# EAGLE design ECU Adapter (EAGLE 9.6.2)
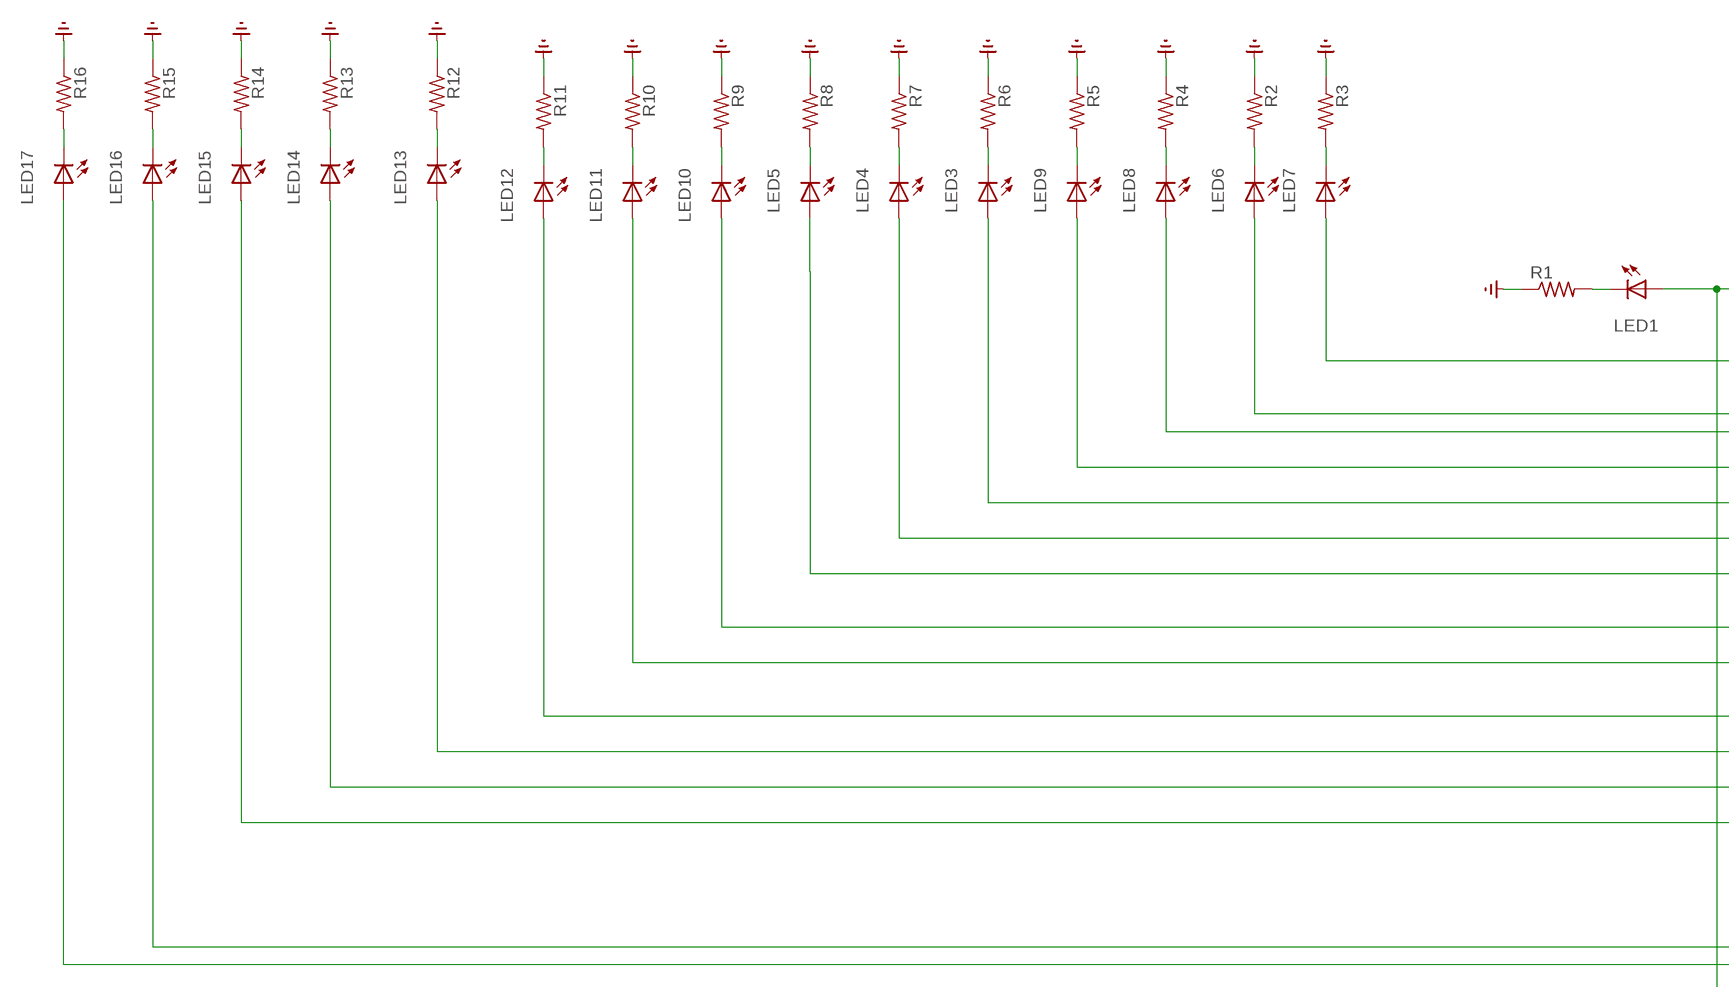
[diagram p0: schematic, sheet 1, part 1 of 2]
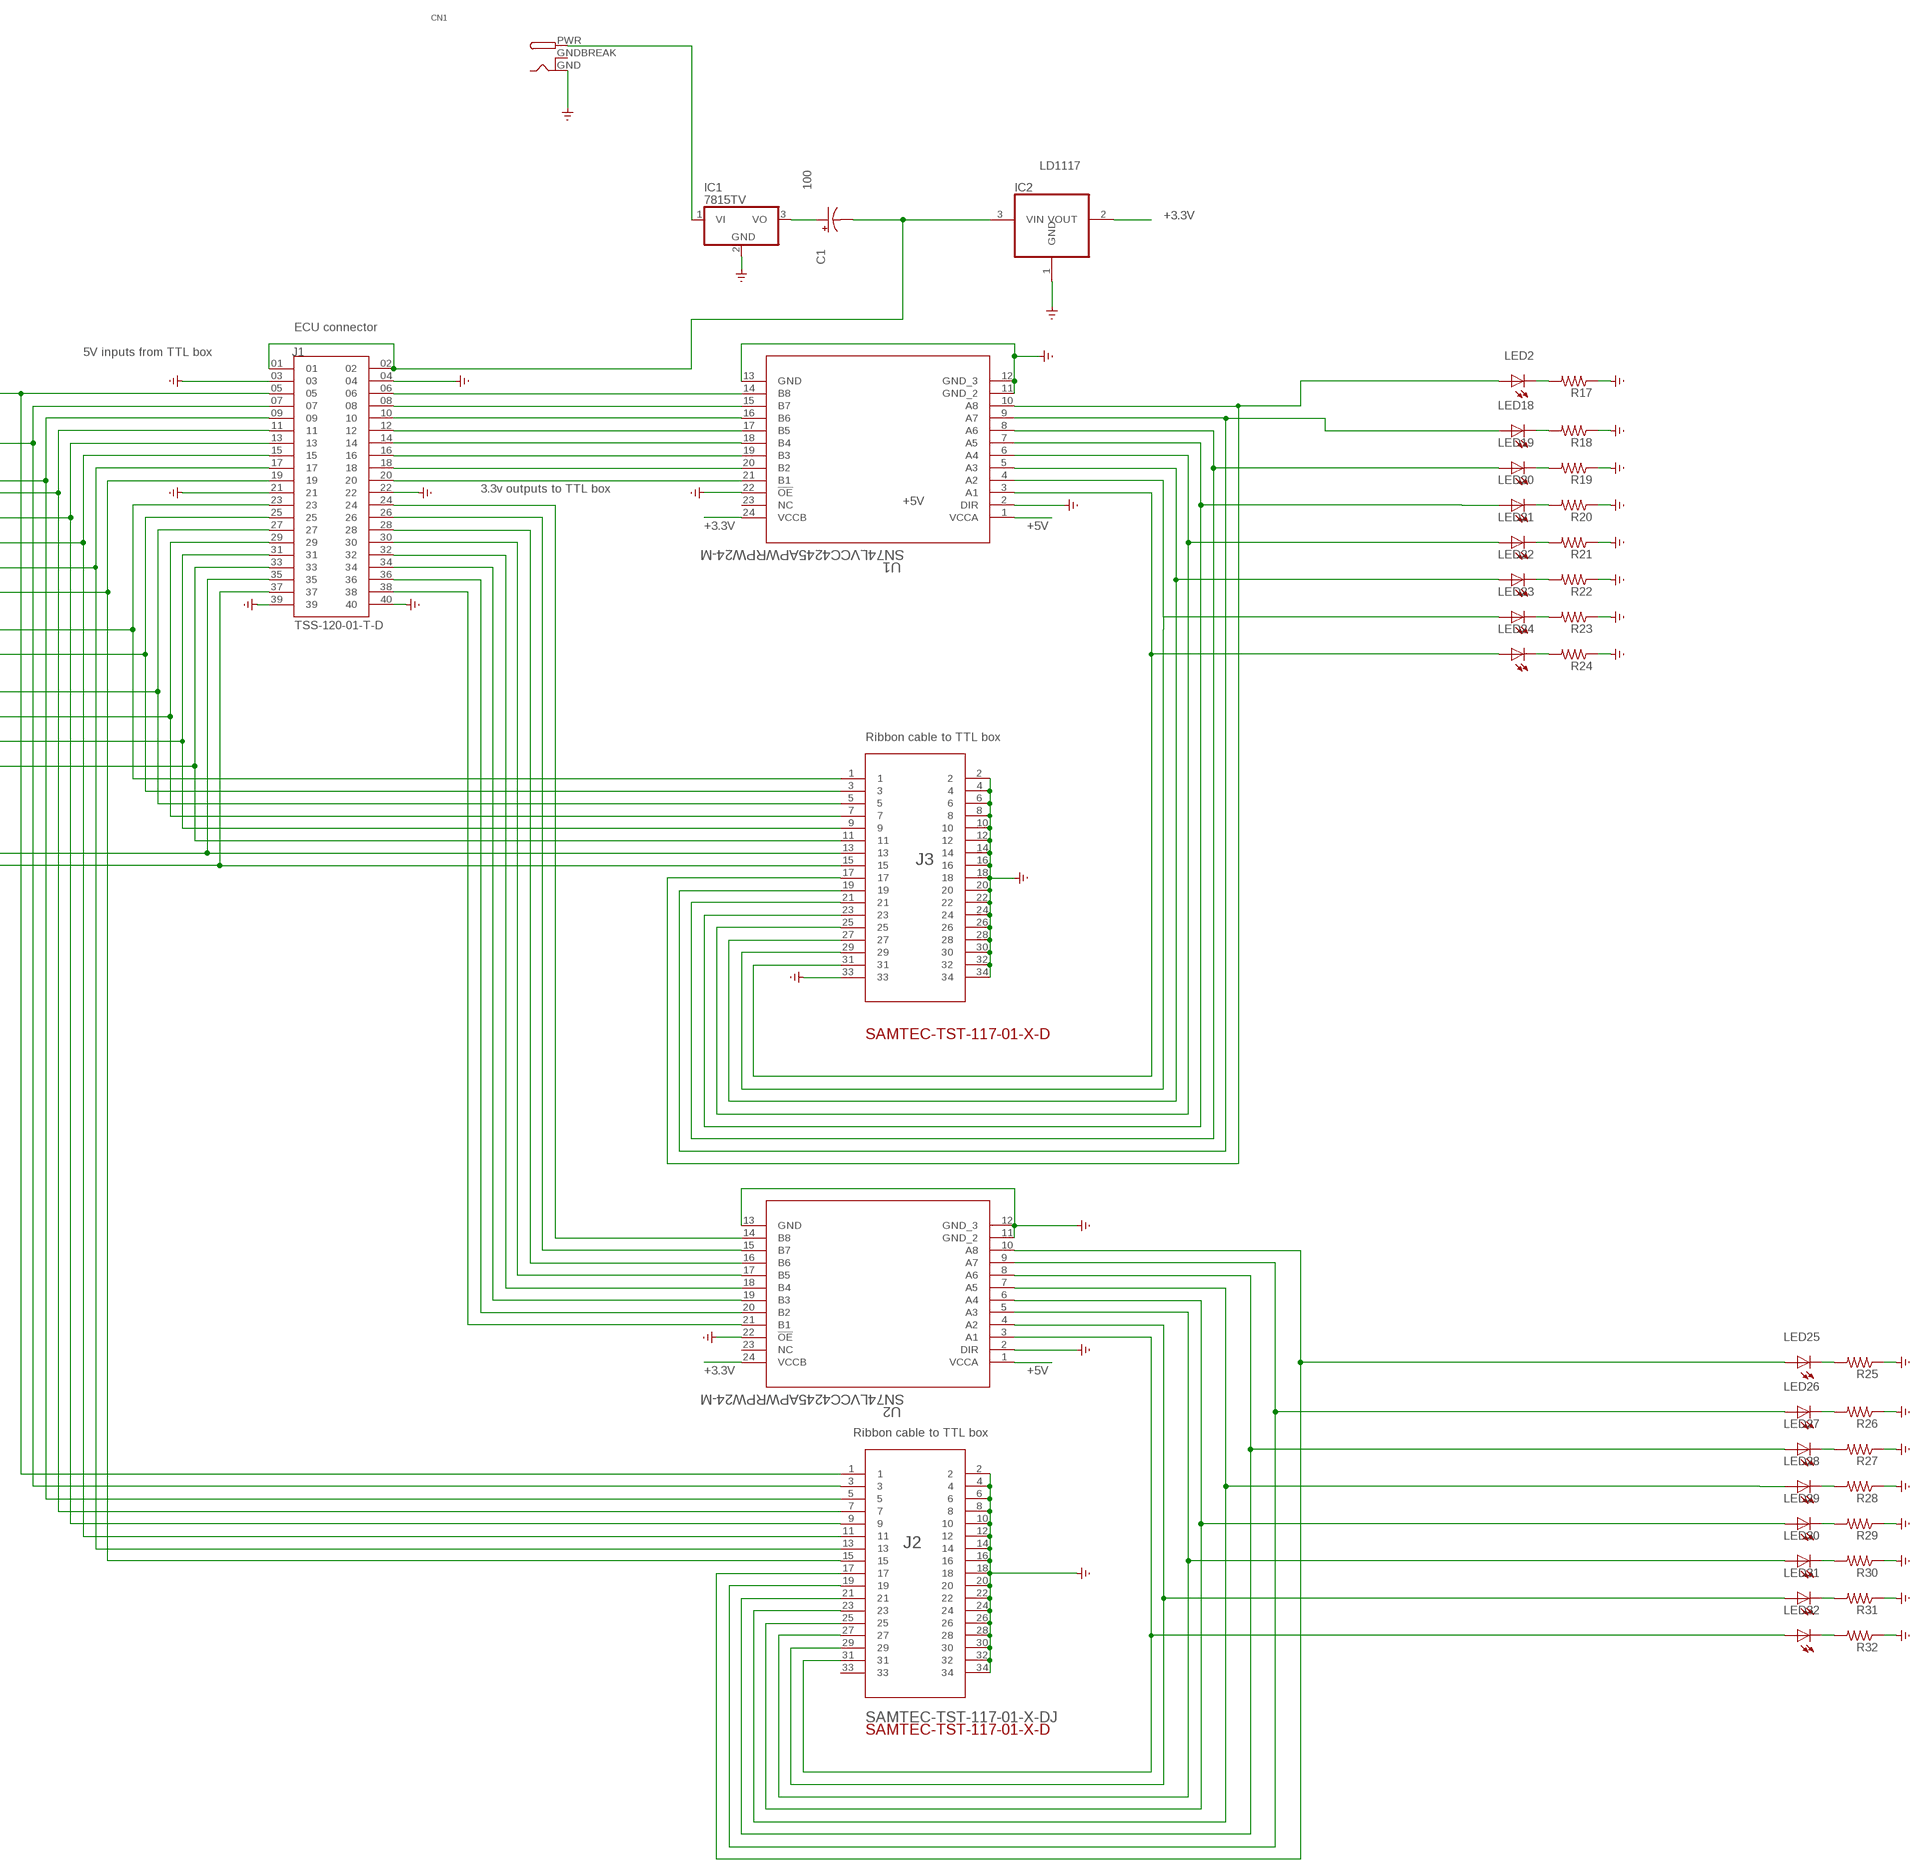
[diagram p1: schematic, sheet 1, part 2 of 2]

## Parts
C1  100  CPOL-USE3.5-10  [E3,5-10]
CN1  DCBARRELPTH  [DCJACK_2MM_PTH]
IC1  7815TV  [TO220V]
IC2  LD1117  [SOT223]
J1  TSS-120-01-T-D  [SAMTEC_TSS-120-01-T-D]
J2  SAMTEC-TST-117-01-X-DJ  [SAMTEC-TST-117-01-X-D]
J3  SAMTEC-TST-117-01-X-DJ  [SAMTEC-TST-117-01-X-D]
LED1  LEDCHIPLED_0603  [CHIPLED_0603]
LED2  LEDCHIPLED_0603  [CHIPLED_0603]
LED3  LEDCHIPLED_0603  [CHIPLED_0603]
LED4  LEDCHIPLED_0603  [CHIPLED_0603]
LED5  LEDCHIPLED_0603  [CHIPLED_0603]
LED6  LEDCHIPLED_0603  [CHIPLED_0603]
LED7  LEDCHIPLED_0603  [CHIPLED_0603]
LED8  LEDCHIPLED_0603  [CHIPLED_0603]
LED9  LEDCHIPLED_0603  [CHIPLED_0603]
LED10  LEDCHIPLED_0603  [CHIPLED_0603]
LED11  LEDCHIPLED_0603  [CHIPLED_0603]
LED12  LEDCHIPLED_0603  [CHIPLED_0603]
LED13  LEDCHIPLED_0603  [CHIPLED_0603]
LED14  LEDCHIPLED_0603  [CHIPLED_0603]
LED15  LEDCHIPLED_0603  [CHIPLED_0603]
LED16  LEDCHIPLED_0603  [CHIPLED_0603]
LED17  LEDCHIPLED_0603  [CHIPLED_0603]
LED18  LEDCHIPLED_0603  [CHIPLED_0603]
LED19  LEDCHIPLED_0603  [CHIPLED_0603]
LED20  LEDCHIPLED_0603  [CHIPLED_0603]
LED21  LEDCHIPLED_0603  [CHIPLED_0603]
LED22  LEDCHIPLED_0603  [CHIPLED_0603]
LED23  LEDCHIPLED_0603  [CHIPLED_0603]
LED24  LEDCHIPLED_0603  [CHIPLED_0603]
LED25  LEDCHIPLED_0603  [CHIPLED_0603]
LED26  LEDCHIPLED_0603  [CHIPLED_0603]
LED27  LEDCHIPLED_0603  [CHIPLED_0603]
LED28  LEDCHIPLED_0603  [CHIPLED_0603]
LED29  LEDCHIPLED_0603  [CHIPLED_0603]
LED30  LEDCHIPLED_0603  [CHIPLED_0603]
LED31  LEDCHIPLED_0603  [CHIPLED_0603]
LED32  LEDCHIPLED_0603  [CHIPLED_0603]
R1  R-US_R0603  [R0603]
R2  R-US_R0603  [R0603]
R3  R-US_R0603  [R0603]
R4  R-US_R0603  [R0603]
R5  R-US_R0603  [R0603]
R6  R-US_R0603  [R0603]
R7  R-US_R0603  [R0603]
R8  R-US_R0603  [R0603]
R9  R-US_R0603  [R0603]
R10  R-US_R0603  [R0603]
R11  R-US_R0603  [R0603]
R12  R-US_R0603  [R0603]
R13  R-US_R0603  [R0603]
R14  R-US_R0603  [R0603]
R15  R-US_R0603  [R0603]
R16  R-US_R0603  [R0603]
R17  R-US_R0603  [R0603]
R18  R-US_R0603  [R0603]
R19  R-US_R0603  [R0603]
R20  R-US_R0603  [R0603]
R21  R-US_R0603  [R0603]
R22  R-US_R0603  [R0603]
R23  R-US_R0603  [R0603]
R24  R-US_R0603  [R0603]
R25  R-US_R0603  [R0603]
R26  R-US_R0603  [R0603]
R27  R-US_R0603  [R0603]
R28  R-US_R0603  [R0603]
R29  R-US_R0603  [R0603]
R30  R-US_R0603  [R0603]
R31  R-US_R0603  [R0603]
R32  R-US_R0603  [R0603]
U1  SN74LVCC4245APWRPW24-M  [PW24-M]
U2  SN74LVCC4245APWRPW24-M  [PW24-M]

## Nets
+3.3V: IC2.2(VOUT) U1.24(VCCB) U2.24(VCCB)
+5V: C1.- IC2.3(VIN) J1.01 J1.02 U1.1(VCCA) U2.1(VCCA)
GND: CN1.GND IC1.2(GND) IC2.1(GND) J1.03 J1.04 J1.21 J1.22 J1.39 J1.40 J2.2 J2.4 J2.6 J2.8 J2.10 J2.12 J2.14 J2.16 J2.18 J2.20 J2.22 J2.24 J2.26 J2.28 J2.30 J2.32 J2.34 J3.2 J3.4 J3.6 J3.8 J3.10 J3.12 J3.14 J3.16 J3.18 J3.20 J3.22 J3.24 J3.26 J3.28 J3.30 J3.32 J3.33 J3.34 R1.1 R2.1 R3.1 R4.1 R5.1 R6.1 R7.1 R8.1 R9.1 R10.1 R11.1 R12.1 R13.1 R14.1 R15.1 R16.1 R17.1 R18.1 R19.1 R20.1 R21.1 R22.1 R23.1 R24.1 R25.1 R26.1 R27.1 R28.1 R29.1 R30.1 R31.1 R32.1 U1.2(DIR) U1.11(GND_2) U1.12(GND_3) U1.13(GND) U1.22(!OE) U2.2(DIR) U2.11(GND_2) U2.12(GND_3) U2.13(GND) U2.22(!OE) ; supply symbol labelled SUPPLY0_GND_
N$1: CN1.PWR IC1.1(VI)
N$2: C1.+ IC1.3(VO)
N$4: J2.17 LED25.A U2.10(A8)
N$6: LED25.C R25.2
N$7: LED26.C R26.2
N$8: J1.06 U1.14(B8)
N$9: J1.08 U1.15(B7)
N$10: J1.10 U1.16(B6)
N$11: J1.12 U1.17(B5)
N$12: J1.14 U1.18(B4)
N$13: J1.16 U1.19(B3)
N$14: J1.18 U1.20(B2)
N$15: J1.20 U1.21(B1)
N$17: LED27.C R27.2
N$18: J1.24 U2.14(B8)
N$19: J1.26 U2.15(B7)
N$20: J1.28 U2.16(B6)
N$21: J1.05 J2.1 LED1.A
N$22: J1.29 J3.7 LED13.A
N$23: LED13.C R12.2
N$24: J1.31 J3.9 LED14.A
N$25: LED14.C R13.2
N$26: J1.33 J3.11 LED15.A
N$27: LED15.C R14.2
N$28: J1.35 J3.13 LED16.A
N$29: J2.19 LED26.A U2.9(A7)
N$30: J2.21 LED27.A U2.8(A6)
N$32: J2.25 LED29.A U2.6(A4)
N$33: J2.27 LED30.A U2.5(A3)
N$34: J2.29 LED31.A U2.4(A2)
N$35: J2.31 LED32.A U2.3(A1)
N$36: LED16.C R15.2
N$37: J3.17 LED2.A U1.10(A8)
N$38: LED17.C R16.2
N$39: LED2.C R17.2
N$40: J2.23 LED28.A U2.7(A5)
N$41: LED18.C R18.2
N$42: J3.21 LED19.A U1.8(A6)
N$43: J1.37 J3.15 LED17.A
N$44: J1.30 U2.17(B5)
N$45: J3.19 LED18.A U1.9(A7)
N$46: J1.32 U2.18(B4)
N$47: LED28.C R28.2
N$48: J1.34 U2.19(B3)
N$49: J1.36 U2.20(B2)
N$50: J1.38 U2.21(B1)
N$51: LED1.C R1.2
N$52: J1.09 J2.5 LED6.A
N$53: LED6.C R2.2
N$54: J1.07 J2.3 LED7.A
N$55: LED7.C R3.2
N$56: J1.11 J2.7 LED8.A
N$57: LED8.C R4.2
N$59: J1.13 J2.9 LED9.A
N$60: LED9.C R5.2
N$61: J1.15 J2.11 LED3.A
N$62: LED3.C R6.2
N$63: J1.17 J2.13 LED4.A
N$64: LED4.C R7.2
N$65: J1.19 J2.15 LED5.A
N$66: LED5.C R8.2
N$67: J1.23 J3.1 LED10.A
N$68: LED10.C R9.2
N$69: J1.25 J3.3 LED11.A
N$70: LED11.C R10.2
N$71: J1.27 J3.5 LED12.A
N$72: LED12.C R11.2
N$73: LED19.C R19.2
N$74: J3.23 LED20.A U1.7(A5)
N$75: LED20.C R20.2
N$76: J3.25 LED21.A U1.6(A4)
N$77: LED21.C R21.2
N$78: J3.27 LED22.A U1.5(A3)
N$79: LED22.C R22.2
N$80: J3.29 LED23.A U1.4(A2)
N$81: LED23.C R23.2
N$82: J3.31 LED24.A U1.3(A1)
N$83: LED24.C R24.2
N$85: LED29.C R29.2
N$87: LED30.C R30.2
N$89: LED31.C R31.2
N$91: LED32.C R32.2
Unconnected: J2.33 U1.23(NC) U2.23(NC)

## Notes on the sheet
- ECU connector
- 5V inputs from TTL box
- 3.3v outputs to TTL box
- Ribbon cable to TTL box
- Ribbon cable to TTL box

## Power pins joined to a net without a drawn wire
GNDBREAK: CN1.GNDBREAK

## Library data of the parts
C1 = adafruit:CPOL-US: POLARIZED CAPACITOR, American symbol
CN1 = adafruit:DCBARREL: 2.0mm DC Barrel Jack DCJACK_2MM_PTH - Through Hole Jack (4UConnector: 05537)
IC1 = linear:78*: Positive VOLTAGE REGULATOR Source: http://cache.national.com/ds/LM/LM78L05.pdf http://www.fairchildsemi.com/ds/LM/LM7805.pdf
IC2 = PulseOximeterECG_AU:LD1117: 800mA and 1A Low Dropout (LDO) Positive Regulator 1.8V, 2.5V, 2.85V, 3.3V, 5V, and Adj; MF: TEXAS INSTRUMENTS; MPN: REG1117FAKTTT; OC_FARNELL: 1296120; OC_NEWARK: 87H2562
J1 = 40pin ribbon connector:TSS-120-01-T-D; DESCRIPTION: Connector Header Through Hole 40 position 0.100 (2.54mm); MF: Samtec; MP: TSS-120-01-T-D; PACKAGE: None; PURCHASE-URL: https://pricing.snapeda.com/search/part/TSS-120-01-T-D/?ref=eda
J2 J3 = 34 pin connector:SAMTEC-TST-117-01-X-D; DESCRIPTION: TST - Samtec 2.54mm Shrouded Through Hole Terminal Strip Cable Mate; DIGI-KEY_PART_NUMBER: TST-117-01-L-D-LL-ND; MF: Samtec Inc.; MP: TST-117-01-L-D; PACKAGE: None; PURCHASE-URL: https://pricing.snapeda.com/search/part/TST-117-01-L-D/?ref=eda
LED1-LED32 = adafruit:LED: LED OSRAM: - CHIPLED LG R971, LG N971, LY N971, LG Q971, LY Q971, LO R971, LY R971 LH N974, LH R974 LS Q976, LO Q976, LY Q976 LO Q996 - Hyper CHIPLED LW Q18S LB Q993, LB Q99A, LB R99A - SideLED LS A670, LO A670, LY A670, LG A670, LP A670 LB A673, LV A673, LT A673, LW A673 LH A674 LY A675 LS A676, LA A676, LO A676, LY A676, LW A676 LS A679, LY A679, LG A679 - Hyper Micro SIDELED® LS Y876, LA Y876, LO Y876, LY Y876 LT Y87S - SmartLED LW L88C, LW L88S LB L89C, LB L89S, LG L890 LS L89K, LO L89K, LY L89K LS L896, LA L896, LO L896, LY L896 - TOPLED LS T670, LO T670, LY T670, LG T670, LP T670 LSG T670, LSP T670, LSY T670, LOP T670, LYG T670 LG T671, LOG T671, LSG T671 LB T673, LV T673, LT T673, LW T673 LH T674 LS T676, LA T676, LO T676, LY T676, LB T676, LH T676, LSB T676, LW T676 LB T67C, LV T67C, LT T67C, LS T67K, LO T67K, LY T67K, LW E67C LS E67B, LA E67B, LO E67B, LY E67B, LB E67C, LV E67C, LT E67C LW T67C LS T679, LY T679, LG T679 LS T770, LO T770, LY T770, LG T770, LP T770 LB T773, LV T773, LT T773, LW T773 LH T774 LS E675, LA E675, LY E675, LS T675 LS T776, LA T776, LO T776, LY T776, LB T776 LHGB T686 LT T68C, LB T68C - Hyper Mini TOPLED® LB M676 - Mini TOPLED Santana® LG M470 LS M47K, LO M47K, LY M47K Source: http://www.osram.convergy.de/
R1-R32 = adafruit:R-US_: RESISTOR, American symbol
U1 U2 = octal level shift 2:SN74LVCC4245APWR; DATASHEET_URL: http://www.ti.com/lit/gpn/SN74LVCC4245A; DESCRIPTION: Octal Bus Transceiver With Adjustable Output Voltage and 3-State Outputs; FAMILY_NAME: DIRECTION CONTROL DUAL SUPPLY TRANSLATOR; GENERIC_PART_NUMBER: SN74LVCC4245A; INDUSTRY_STD_PKG_TYPE: TSSOP; MANUFACTURER: Texas Instruments; MANUFACTURER_PART_NUMBER: SN74LVCC4245APWR; PACKAGE_DESIGNATOR: PW; PIN_COUNT: 24; VENDOR: Texas Instruments

## Board
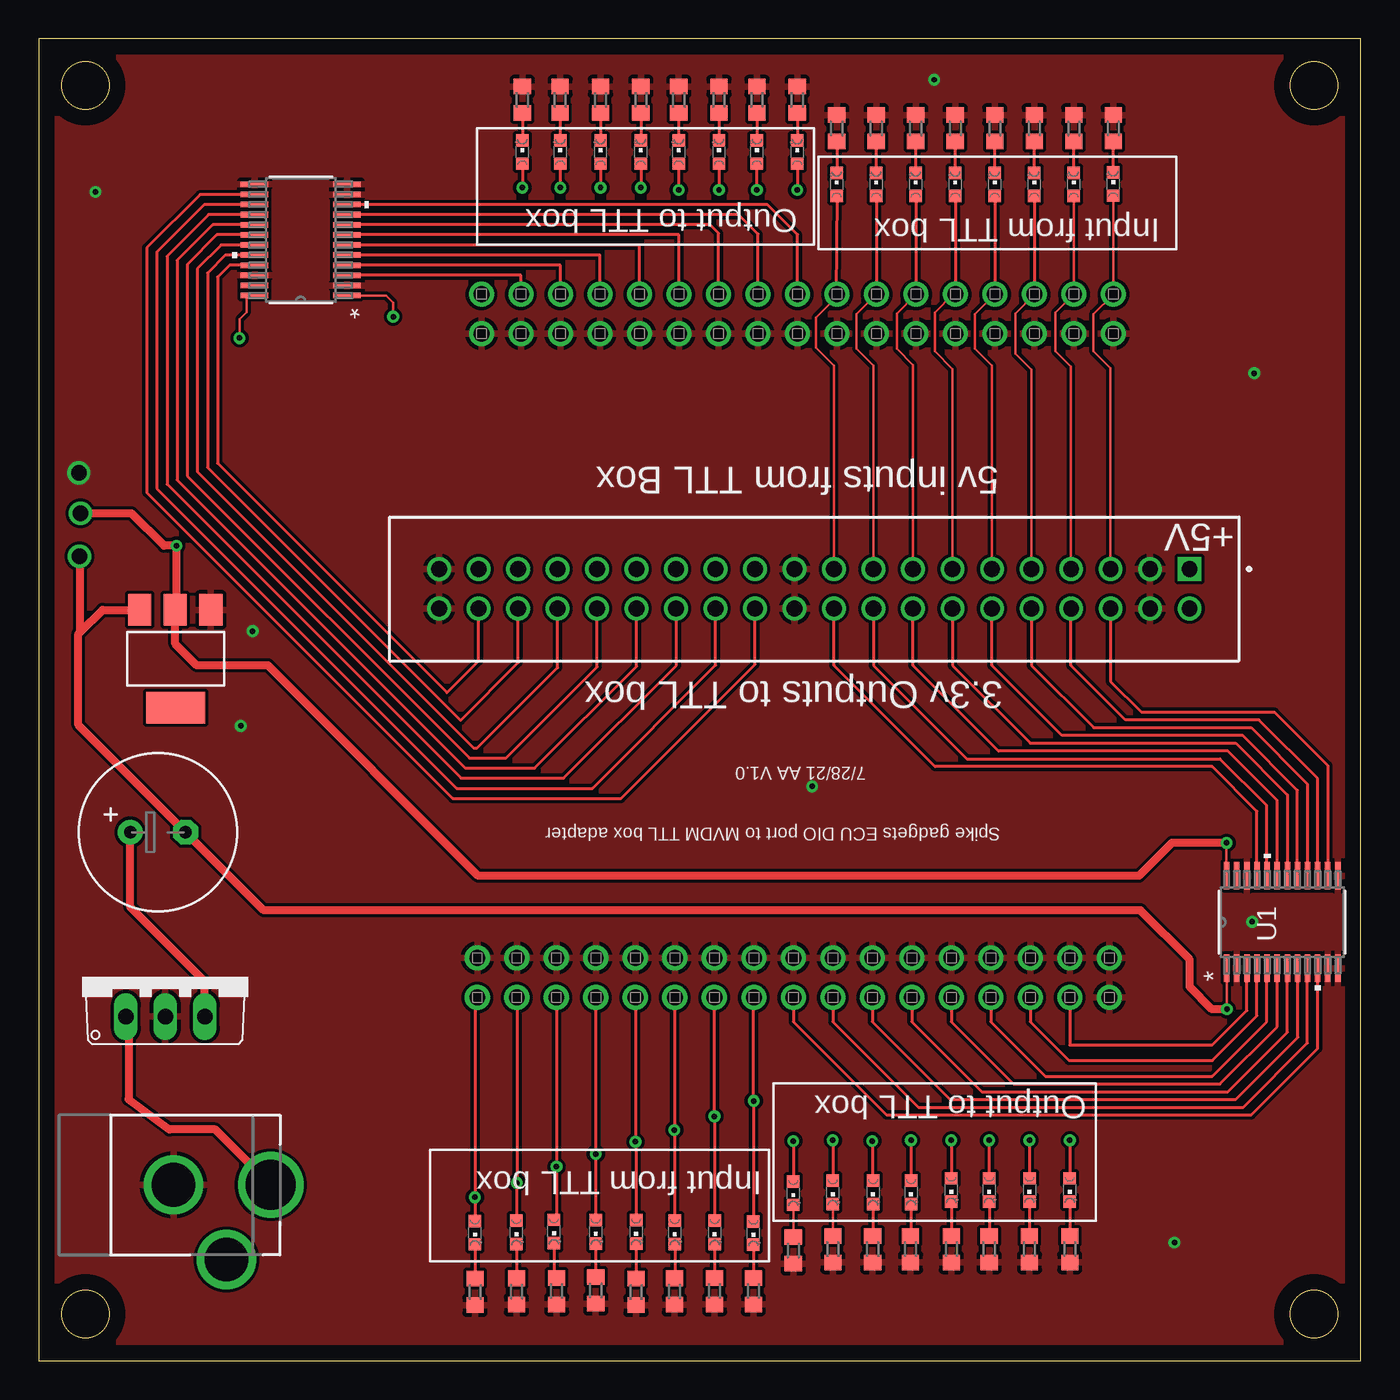
[diagram p2: board, top side]
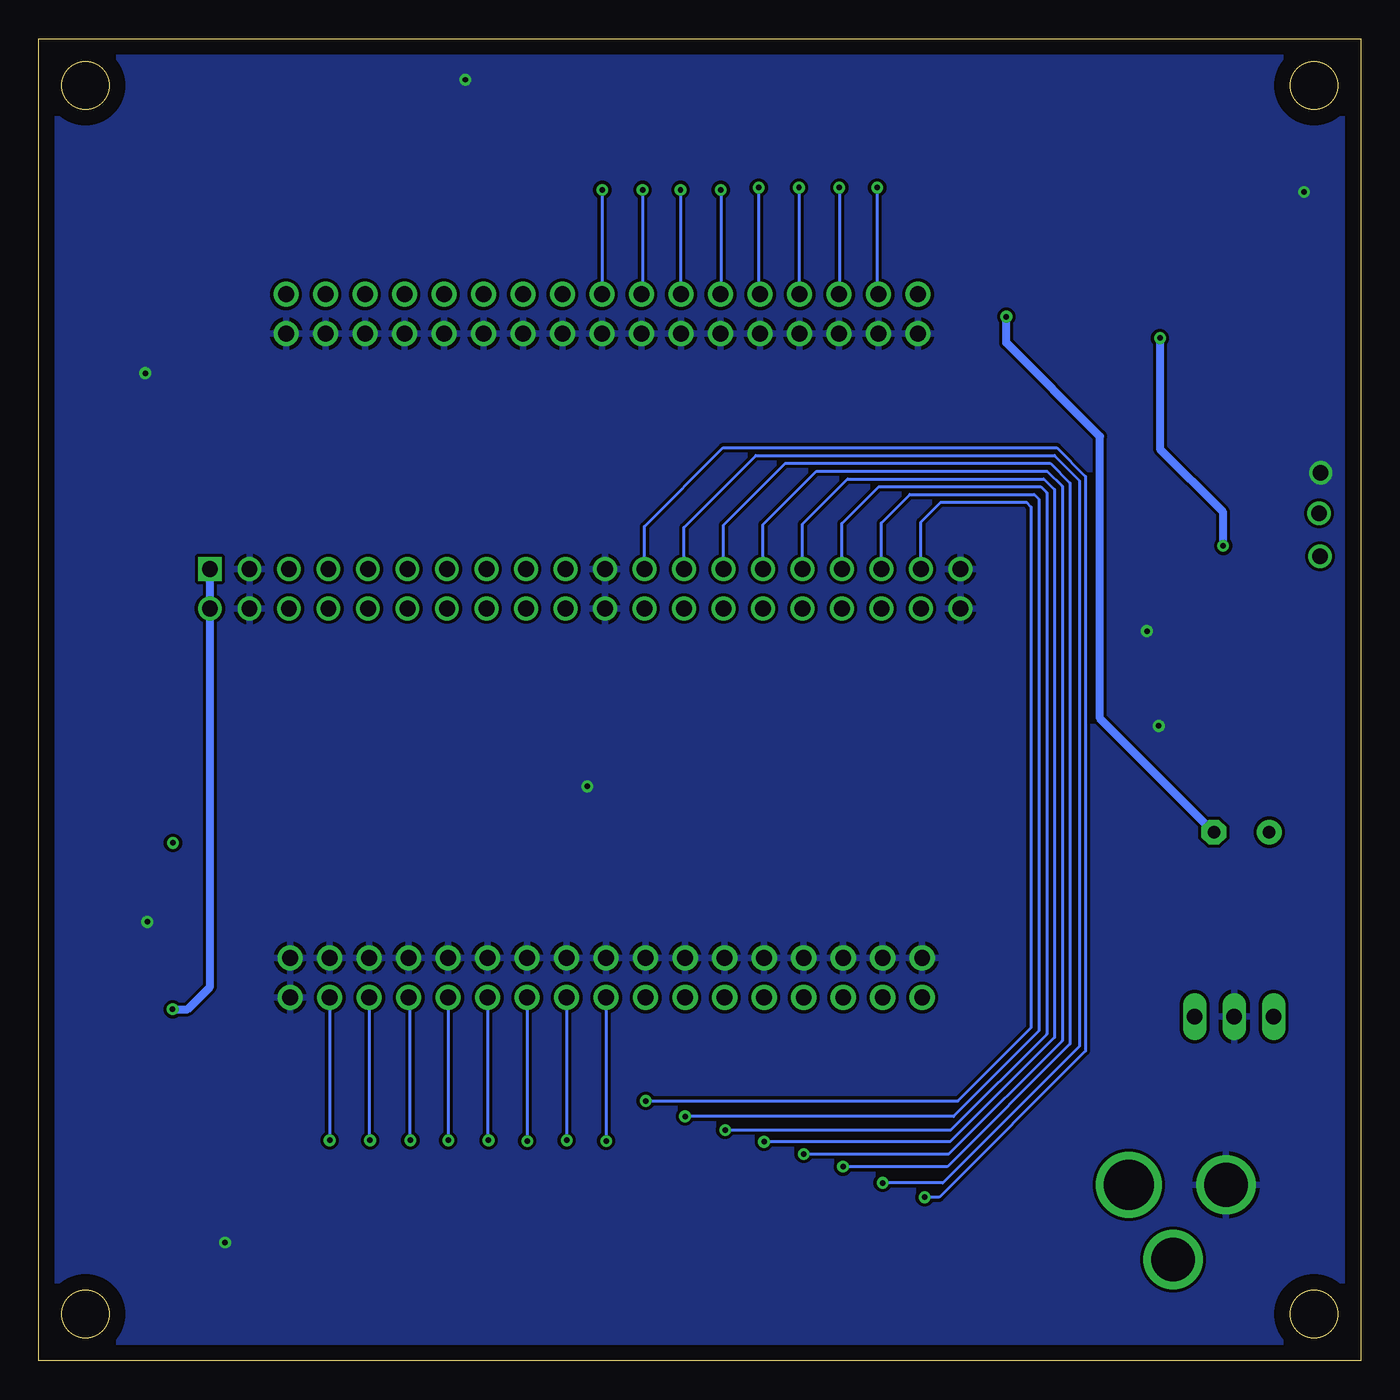
[diagram p3: board, bottom side, seen from below]

Size 85 x 85 mm. Coordinates in mm from the lower left corner, seen from the top.
Outline: 0,0 85,0 85,85 0,85 0,0
Outline: circle at 3,82 radius 1.52
Outline: circle at 82,82 radius 1.52
Outline: circle at 3,3 radius 1.52
Outline: circle at 82,3 radius 1.52
Copper layers (1*16): Top 0.035mm / dielectric 1.5mm / Bottom 0.035mm
Design rules "default": minimum track width 6mil, minimum drill 0.35mm, track to track 6mil, track to pad 6mil, pad to pad 6mil, via to via 6mil, smd to smd 6mil, copper to edge 40mil, drill to drill 6mil, minimum pad ring 10mil, minimum via ring 8mil, stop-mask expansion 4mil, vias tented up to drill 0mil, thermal gap 10mil

### Footprints (pad centres in the part's own frame; a part is rotated, then mirrored left to right if it is on the bottom)
E3,5-10 = drill 0.813 pad 1.6: + -1.778,0 | drill 0.813 pad 1.6 octagon: - 1.778,0
DCJACK_2MM_PTH = drill 2.8: GND 0,7.35; GNDBREAK 4.8,10.75 | drill 3.2: PWR 0,13.6
TO220V = drill 1.016 long: 1 -2.54,-2.54; 2 0,-2.54; 3 2.54,-2.54
SOT223 = smd 1.499 x 2.007: 1 -2.261,-3.15; 2 0.025,-3.15; 3 2.311,-3.15 | smd 3.81 x 2.007: 4 0,3.15
SAMTEC_TSS-120-01-T-D = drill 1.02 pad 1.37 square: 01 0,0 | drill 1.02 pad 1.37: 02 0,2.54; 03 2.54,0; 04 2.54,2.54; 05 5.08,0; 06 5.08,2.54; 07 7.62,0; 08 7.62,2.54; 09 10.16,0; 10 10.16,2.54; 11 12.7,0; 12 12.7,2.54; 13 15.24,0; 14 15.24,2.54; 15 17.78,0; 16 17.78,2.54; 17 20.32,0; 18 20.32,2.54; 19 22.86,0; 20 22.86,2.54; 21 25.4,0; 22 25.4,2.54; 23 27.94,0; 24 27.94,2.54; 25 30.48,0; 26 30.48,2.54; 27 33.02,0; 28 33.02,2.54; 29 35.56,0; 30 35.56,2.54; 31 38.1,0; 32 38.1,2.54; 33 40.64,0; 34 40.64,2.54; 35 43.18,0; 36 43.18,2.54; 37 45.72,0; 38 45.72,2.54; 39 48.26,0; 40 48.26,2.54
SAMTEC-TST-117-01-X-D = drill 1.02 pad 1.62: 1 -20.32,-1.46; 2 -20.32,1.08; 3 -17.78,-1.46; 4 -17.78,1.08; 5 -15.24,-1.46; 6 -15.24,1.08; 7 -12.7,-1.46; 8 -12.7,1.08; 9 -10.16,-1.46; 10 -10.16,1.08; 11 -7.62,-1.46; 12 -7.62,1.08; 13 -5.08,-1.46; 14 -5.08,1.08; 15 -2.54,-1.46; 16 -2.54,1.08; 17 0,-1.46; 18 0,1.08; 19 2.54,-1.46; 20 2.54,1.08; 21 5.08,-1.46; 22 5.08,1.08; 23 7.62,-1.46; 24 7.62,1.08; 25 10.16,-1.46; 26 10.16,1.08; 27 12.7,-1.46; 28 12.7,1.08; 29 15.24,-1.46; 30 15.24,1.08; 31 17.78,-1.46; 32 17.78,1.08; 33 20.32,-1.46; 34 20.32,1.08
CHIPLED_0603 = smd 0.8 x 0.8: A 0,-0.75; C 0,0.75
R0603 = smd 1 x 1.1: 1 -0.85,0; 2 0.85,0
PW24-M = smd 1.778 x 0.356: 1 -2.972,3.575; 2 -2.972,2.925; 3 -2.972,2.275; 4 -2.972,1.625; 5 -2.972,0.975; 6 -2.972,0.325; 7 -2.972,-0.325; 8 -2.972,-0.975; 9 -2.972,-1.625; 10 -2.972,-2.275; 11 -2.972,-2.925; 12 -2.972,-3.575; 13 2.972,-3.575; 14 2.972,-2.925; 15 2.972,-2.275; 16 2.972,-1.625; 17 2.972,-0.975; 18 2.972,-0.325; 19 2.972,0.325; 20 2.972,0.975; 21 2.972,1.625; 22 2.972,2.275; 23 2.972,2.925; 24 2.972,3.575

### Placement (x,y rotation side)
C1  7.66,33.98 0 top
CN1  1.31,11.3 270 top
IC1  8.13,24.66 0 top
IC2  8.8,45.14 180 top
J1  74,50.9 180 top
J2  48.79,67.12 180 top
J3  48.52,24.82 0 top
LED1  69.09,75.67 0 top
LED2  48.51,10.77 180 top
LED3  56.39,75.64 0 top
LED4  53.85,75.64 0 top
LED5  51.31,75.64 0 top
LED6  64.01,75.64 0 top
LED7  66.55,75.64 0 top
LED8  61.47,75.64 0 top
LED9  58.93,75.64 0 top
LED10  28.04,8.23 180 top
LED11  30.71,8.26 180 top
LED12  33.12,8.31 180 top
LED13  35.81,8.28 180 top
LED14  38.4,8.28 180 top
LED15  40.89,8.26 180 top
LED16  43.46,8.26 180 top
LED17  45.95,8.2 180 top
LED18  51.05,10.82 180 top
LED19  53.64,10.82 180 top
LED20  56.08,10.82 180 top
LED21  58.67,10.97 180 top
LED22  61.11,10.97 180 top
LED23  63.7,10.97 180 top
LED24  66.29,10.97 180 top
LED25  48.77,77.72 0 top
LED26  46.18,77.72 0 top
LED27  43.74,77.72 0 top
LED28  41.15,77.72 0 top
LED29  38.71,77.72 0 top
LED30  36.12,77.72 0 top
LED31  33.53,77.72 0 top
LED32  31.09,77.72 0 top
R1  69.09,79.25 270 top
R2  64.01,79.25 270 top
R3  66.55,79.25 270 top
R4  61.47,79.25 270 top
R5  58.93,79.25 270 top
R6  56.39,79.25 270 top
R7  53.85,79.25 270 top
R8  51.31,79.25 270 top
R9  28.04,4.42 90 top
R10  30.71,4.45 90 top
R11  33.3,4.47 90 top
R12  35.81,4.52 90 top
R13  38.4,4.42 90 top
R14  40.87,4.45 90 top
R15  43.46,4.47 90 top
R16  45.95,4.47 90 top
R17  48.51,7.09 90 top
R18  51.05,7.16 90 top
R19  53.62,7.16 90 top
R20  56.06,7.16 90 top
R21  58.67,7.16 90 top
R22  61.11,7.16 90 top
R23  63.7,7.16 90 top
R24  66.29,7.16 90 top
R25  48.77,81.08 270 top
R26  46.18,81.08 270 top
R27  43.74,81.08 270 top
R28  41.15,81.08 270 top
R29  38.71,81.08 270 top
R30  36.12,81.08 270 top
R31  33.53,81.08 270 top
R32  31.09,81.08 270 top
U1  79.96,28.2 90 top
U2  16.84,72.07 180 top

### Tracks (layer width: path | path; a pad name or v marks a point on that pad's centre or on a via)
+3.3V  (via drill 0.35, 1)
  Top 0.152: U2.24 13.81,68.55 13.41,68.55 13.36,68.6 13.36,67.44 12.9,66.98 v12.9,65.76 | U1.24 v76.38,33.3
  Top 0.508: v76.38,33.3 72.87,33.3 70.75,31.18 28.26,31.18 14.73,44.7 10.16,44.7 8.77,46.09 IC2.2 8.84,48.35 v8.84,52.4 8.05,52.4 5.97,54.48 v2.67,54.48
  Bottom 0.508: v8.84,52.4 8.84,54.56 12.9,58.62 v12.9,65.76
+5V  (via drill 0.35, 1)
  Top 0.152: U1.1 76.39,22.61 v76.4,22.6 | U2.1 22.34,68.5 22.78,68.05 v22.78,67.13
  Top 0.508: 2.62,46.81 4.09,48.29 IC2.3 | 2.62,46.81 2.54,46.74 2.54,40.88 C1.- 14.46,28.96 70.84,28.96 74,25.8 74,24.04 75.44,22.6 v76.4,22.6 | v2.62,51.71 2.62,46.81
  Bottom 0.508: C1.- 16.76,41.31 16.76,59.44 22.78,65.46 v22.78,67.13 | v76.4,22.6 75.44,22.6 74,24.05 J1.02 J1.01
GND  (via drill 0.35, 1)
  other vias: 49.73,36.93 78.03,28.22 3.63,75.16 57.58,82.37 78.16,63.5 73.03,7.59 2.57,57.1 12.98,40.82 13.74,46.91
  pour Bottom (isolate 0.203): -4.86,100.49 92.8,100.49 92.8,-7.62 -4.73,-8.22
  pour Top (isolate 0.203): -9.1,103.5 -9.1,-5 90.89,-5 90.89,103.5
N$1
  Top 0.508: IC1.1 5.77,21.95 5.77,16.81 8.4,14.86 11.35,14.86 CN1.PWR
N$2
  Top 0.508: IC1.3 10.67,24.38 5.88,29.17 C1.+
N$4  (via drill 0.35)
  Top 0.203: J2.17 48.79,72.41 46.85,74.34 U2.10 | LED25.A v48.77,75.29
  Bottom 0.203: v48.77,75.29 48.77,68.58 J2.17
N$6
  Top 0.203: R25.2 LED25.C
N$7
  Top 0.203: R26.2 LED26.C
N$8
  Top 0.203: J1.06 68.92,43.69 70.9,41.7 79.46,41.7 82.89,38.28 U1.14
N$9
  Top 0.203: J1.08 66.38,44.7 69.88,41.2 78.46,41.2 82.23,37.43 U1.15
N$10
  Top 0.203: J1.10 63.84,44.7 67.84,40.7 77.96,40.7 81.58,37.08 U1.16
N$11
  Top 0.203: J1.12 61.3,44.7 65.8,40.2 77.41,40.2 80.94,36.68 U1.17
N$12
  Top 0.203: J1.14 58.76,44.7 63.76,39.7 76.96,39.7 80.28,36.38 U1.18
N$13
  Top 0.203: J1.16 56.22,44.7 61.72,39.2 76.46,39.2 79.64,36.03 U1.19
N$14
  Top 0.203: J1.18 53.68,44.7 59.68,38.7 75.96,38.7 78.96,35.7 78.96,31.2 U1.20
N$15
  Top 0.203: J1.20 51.14,44.7 57.64,38.2 75.46,38.2 78.33,35.33 U1.21
N$17
  Top 0.203: R27.2 LED27.C
N$18
  Top 0.203: U2.14 10.37,75 6.94,71.56 6.94,55.82 26.61,36.15 37.44,36.15 46.06,44.77 J1.24
N$19
  Top 0.203: U2.15 10.64,74.34 7.59,71.3 7.59,56.09 26.88,36.8 35.59,36.8 43.52,44.73 J1.26
N$20
  Top 0.203: J1.28 40.99,48.34 40.99,44.7 33.74,37.45 27.15,37.45 8.24,56.36 8.24,71.03 10.91,73.69 U2.16
N$21
  Top 0.152: J2.1 69.09,68.56 | 69.09,68.56 67.82,67.29 67.82,64.92 68.92,63.82 J1.05 | LED1.A 69.09,68.56
N$22  (via drill 0.35)
  Top 0.203: J3.7 v35.82,13.29 v35.81,13.29 LED13.A | LED13.A
  Bottom 0.203: J1.29 38.44,53.76 34.99,57.2 20.16,57.2 19.19,56.23 19.19,20.58 26.48,13.29 v35.81,13.29
N$23
  Top 0.203: LED13.C R12.2
N$24  (via drill 0.35)
  Top 0.203: J3.9 v38.37,14.08 38.41,14.08 LED14.A
  Bottom 0.203: J1.31 35.9,53.8 32.99,56.7 20.37,56.7 19.69,56.02 19.69,20.78 26.4,14.08 v38.37,14.08
N$25
  Top 0.203: LED14.C R13.2
N$26  (via drill 0.35)
  Top 0.203: J3.11 40.89,14.86 v40.87,14.83 40.87,9.01 LED15.A
  Bottom 0.203: J1.33 33.36,53.84 30.99,56.2 20.58,56.2 20.19,55.82 20.19,20.99 26.35,14.83 v40.87,14.83
N$27
  Top 0.203: LED15.C 40.89,5.29 R14.2
N$28  (via drill 0.35)
  Top 0.203: J3.13 v43.44,15.71 v43.44,15.7 43.44,9.01 LED16.A
  Bottom 0.203: J1.35 30.82,53.88 28.99,55.7 20.99,55.7 20.69,55.41 20.69,21.2 26.18,15.7 v43.44,15.7
N$29  (via drill 0.35)
  Top 0.203: J2.19 46.25,72.45 45,73.69 U2.9 | v46.18,75.29 LED26.A
  Bottom 0.203: v46.18,75.29 46.18,68.58 J2.19
N$30  (via drill 0.35)
  Top 0.203: J2.21 43.71,72.49 43.15,73.05 U2.8 | LED27.A v43.74,75.29
  Bottom 0.203: v43.74,75.29 43.74,68.58 J2.21
N$32  (via drill 0.35)
  Top 0.203: J2.25 38.63,71.75 U2.6 | LED29.A v38.71,75.44
  Bottom 0.203: v38.71,75.44 38.71,68.58 J2.25
N$33  (via drill 0.35)
  Top 0.203: J2.27 36.09,71.09 U2.5 | LED30.A v36.12,75.44
  Bottom 0.203: v36.12,75.44 36.12,68.58 J2.27
N$34  (via drill 0.35)
  Top 0.203: J2.29 33.55,70.44 U2.4 | LED31.A v33.53,75.44
  Bottom 0.203: v33.53,75.44 33.53,68.58 J2.29
N$35  (via drill 0.35)
  Top 0.203: J2.31 31.01,69.8 U2.3 | LED32.A v31.09,75.44
  Bottom 0.203: v31.09,75.44 31.09,68.58 J2.31
N$36
  Top 0.203: LED16.C R15.2
N$37  (via drill 0.35)
  Top 0.203: J3.17 48.52,21.8 54.52,15.79 77.96,15.79 82.23,20.07 U1.10 | v48.51,14.12 LED2.A
  Bottom 0.203: J3.17 v48.52,14.12 v48.51,14.12
N$38
  Top 0.203: LED17.C R16.2
N$39
  Top 0.152: LED2.C R17.2
N$40  (via drill 0.35)
  Top 0.203: J2.23 41.17,72.39 U2.7 | LED28.A v41.15,75.29
  Bottom 0.203: v41.15,75.29 41.15,68.58 J2.23
N$41
  Top 0.152: LED18.C R18.2
N$42  (via drill 0.35)
  Top 0.203: J3.21 53.6,21.8 58.6,16.8 76.96,16.8 80.96,20.8 80.96,25.21 U1.8 | v53.59,14.12 53.59,11.62 LED19.A
  Bottom 0.203: J3.21 v53.6,14.12 v53.59,14.12
N$43  (via drill 0.35)
  Top 0.203: J3.15 v45.97,16.7 45.97,8.95 LED17.A
  Bottom 0.203: J1.37 28.28,53.92 26.99,55.2 21.49,55.2 21.19,54.9 21.19,21.4 25.89,16.7 v45.97,16.7
N$44
  Top 0.203: U2.17 11.18,73.05 8.89,70.76 8.89,56.63 27.41,38.1 31.89,38.1 38.44,44.65 J1.30
N$45  (via drill 0.35)
  Top 0.203: J3.19 51.06,21.8 56.56,16.3 77.46,16.3 81.58,20.42 U1.9 | v51.05,14.17 LED18.A
  Bottom 0.203: J3.19 v51.06,14.17 v51.05,14.17
N$46
  Top 0.203: U2.18 11.45,72.39 9.54,70.49 9.54,56.9 27.68,38.75 30.04,38.75 35.9,44.61 J1.32
N$47
  Top 0.203: R28.2 LED28.C
N$48
  Top 0.203: U2.19 11.72,71.75 10.19,70.22 10.19,57.17 27.95,39.4 28.19,39.4 33.36,44.57 J1.34
N$49
  Top 0.203: U2.20 11.99,71.09 10.84,69.95 10.84,57.44 27.11,41.17 30.82,44.88 J1.36
N$50
  Top 0.203: U2.21 12.26,70.44 11.49,69.68 11.49,57.7 26.24,42.95 28.28,44.99 J1.38
N$51
  Top 0.203: LED1.C R1.2
N$52
  Top 0.152: J2.5 62.79,67.34 62.79,64.77 63.84,63.72 J1.09
  Top 0.203: LED6.A 64.03,74.97 J2.5
N$53
  Top 0.203: LED6.C R2.2
N$54
  Top 0.152: J1.07 66.38,63.92 65.38,64.92 65.38,67.39 J2.3 66.57,74.87 LED7.A
N$55
  Top 0.203: LED7.C R3.2
N$56
  Top 0.152: J2.7 60.2,67.29 60.2,65.08 61.3,63.98 J1.11
  Top 0.203: J2.7 61.49,74.89 LED8.A
N$57
  Top 0.203: LED8.C R4.2
N$59
  Top 0.152: J2.9 58.79,68.58 57.61,67.39 57.61,64.92 58.76,63.77 J1.13
  Top 0.203: LED9.A 58.93,68.58 J2.9
N$60
  Top 0.203: LED9.C R5.2
N$61
  Top 0.152: J2.11 55.17,67.34 55.17,65.08 56.22,64.03 J1.15
  Top 0.203: LED3.A 56.41,74.97 J2.11
N$62
  Top 0.203: LED3.C R6.2
N$63
  Top 0.152: J2.13 52.58,67.29 52.58,65.08 53.68,63.98 J1.17
  Top 0.203: LED4.A 53.85,68.58 J2.13
N$64
  Top 0.203: LED4.C R7.2
N$65
  Top 0.152: J2.15 51.33,68.42 49.98,67.08 49.98,65.15 51.14,64 J1.19
  Top 0.203: LED5.A 51.27,68.58 J2.15
N$66
  Top 0.203: R8.2 LED5.C
N$67  (via drill 0.35)
  Top 0.203: J3.1 28.04,23.2 v28.04,10.5 LED10.A
  Bottom 0.203: J1.23 46.06,53.64 40.99,58.7 19.54,58.7 17.69,56.85 17.69,19.9 27.09,10.5 v28.04,10.5
N$68
  Top 0.203: LED10.C R9.2
N$69  (via drill 0.35)
  Top 0.203: J3.3 v30.74,11.43 v30.73,11.43 30.73,9.01 LED11.A
  Bottom 0.203: J1.25 43.52,53.58 38.89,58.2 19.69,58.2 18.09,56.6 18.09,20.2 26.87,11.43 v30.73,11.43
N$70
  Top 0.203: LED11.C R10.2
N$71  (via drill 0.35)
  Top 0.203: J3.5 33.28,12.48 v33.29,12.47 33.29,9.06 LED12.A
  Bottom 0.203: J1.27 40.98,53.72 36.99,57.7 19.96,57.7 18.69,56.44 18.69,20.37 26.59,12.47 v33.29,12.47
N$72
  Top 0.203: LED12.C 33.12,5.32 R11.2
N$73
  Top 0.203: LED19.C 53.65,8.01 R19.2
N$74  (via drill 0.35)
  Top 0.203: J3.23 56.14,21.8 60.64,17.3 76.46,17.3 80.28,21.12 U1.7 | v56.08,14.17 LED20.A
  Bottom 0.203: J3.23 56.14,14.17 v56.08,14.17
N$75
  Top 0.203: LED20.C 56.08,8.01 R20.2
N$76  (via drill 0.35)
  Top 0.203: J3.25 58.68,21.8 62.68,17.8 75.96,17.8 79.64,21.47 U1.6 | v58.67,14.17 LED21.A
  Bottom 0.203: J3.25 v58.68,14.17 v58.67,14.17
N$77
  Top 0.203: LED21.C R21.2
N$78  (via drill 0.35)
  Top 0.203: J3.27 61.22,21.8 64.72,18.3 75.46,18.3 78.96,21.8 78.96,25.21 U1.5 | LED22.A v61.11,14.17
  Bottom 0.203: v61.11,14.17 61.11,23.36 J3.27
N$79
  Top 0.203: LED22.C R22.2
N$80  (via drill 0.35)
  Top 0.203: J3.29 63.76,21.8 66.25,19.3 75.47,19.3 78.33,22.17 U1.4 | v63.7,14.17 LED23.A
  Bottom 0.203: J3.29 63.76,14.17 v63.7,14.17
N$81
  Top 0.203: LED23.C R23.2
N$82  (via drill 0.35)
  Top 0.203: J3.31 66.3,20.3 75.46,20.3 77.69,22.52 U1.3 | v66.29,14.17 LED24.A
  Bottom 0.203: J3.31 v66.3,14.17 v66.29,14.17
N$83
  Top 0.203: LED24.C R24.2
N$85
  Top 0.203: R29.2 LED29.C
N$87
  Top 0.203: R30.2 LED30.C
N$89
  Top 0.203: R31.2 LED31.C
N$91
  Top 0.203: R32.2 LED32.C

### Text on the board
tNames: Output to TTL box | Input from TTL box | 5v inputs from TTL Box | +5V | 3.3v Outputs to TTL box | 7/28/21 AA V1.0 | Spike gadgets ECU DIO port to MVDM TTL box adapter | Output to TTL box | Input from TTL box
tValues: GND | 3.3v | 5V